# EAGLE design circuitPendulum4TIA01 screenShot (EAGLE 7.7.0)
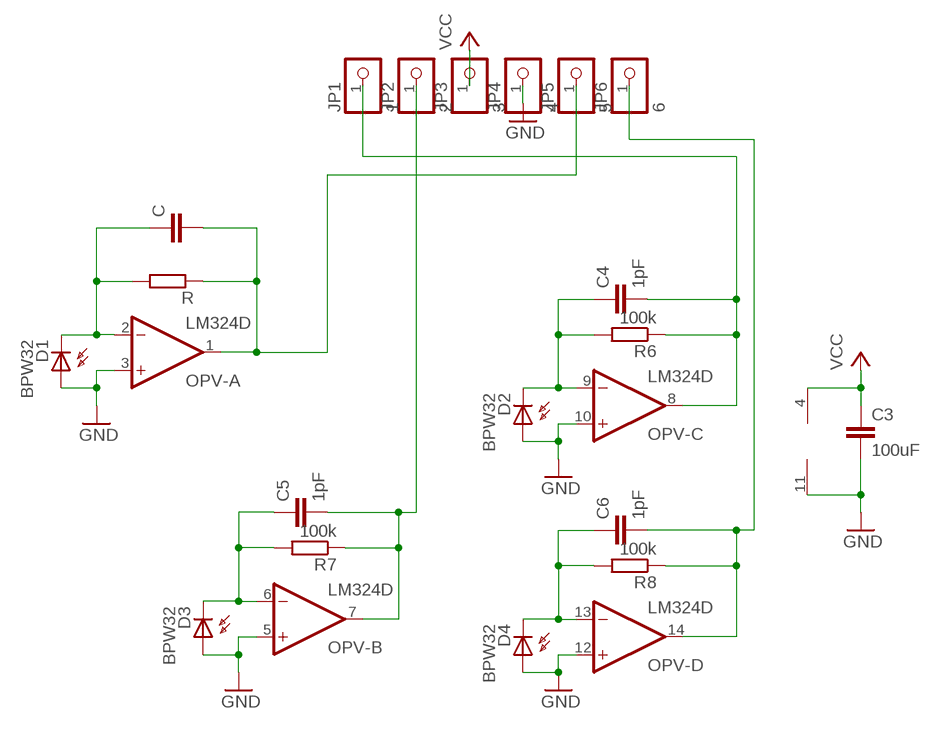
[diagram p0: schematic, sheet 1]

## Parts
C  C-EUC0603  [C0603]
C3  100uF  C-EUC0603  [C0603]
C4  1pF  C-EUC0603  [C0603]
C5  1pF  C-EUC0603  [C0603]
C6  1pF  C-EUC0603  [C0603]
D1  BPW32  [BPW32]
D2  BPW32  [BPW32]
D3  BPW32  [BPW32]
D4  BPW32  [BPW32]
JP1  1  PINHD-1X1_2.54-SMD  [1X01SMD]
JP2  2  PINHD-1X1_2.54-SMD  [1X01SMD]
JP3  3  PINHD-1X1_2.54-SMD  [1X01SMD]
JP4  4  PINHD-1X1_2.54-SMD  [1X01SMD]
JP5  5  PINHD-1X1_2.54-SMD  [1X01SMD]
JP6  6  PINHD-1X1_2.54-SMD  [1X01SMD]
OPV-  LM324D  [SO14]
R  R-EU_R0603  [R0603]
R6  100k  R-EU_R0603  [R0603]
R7  100k  R-EU_R0603  [R0603]
R8  100k  R-EU_R0603  [R0603]

## Nets
GND: C3.2 D1.A D2.A D3.A D4.A JP4.1 OPV-.3(A:+IN) OPV-.5(B:+IN) OPV-.10(C:+IN) OPV-.11(P:V-) OPV-.12(D:+IN)
N$1: C.2 JP5.1 OPV-.1(A:OUT) R.1
N$7: C4.2 JP1.1 OPV-.8(C:OUT) R6.1
N$8: C.1 D1.K(C) OPV-.2(A:-IN) R.2
N$9: C5.1 D3.K(C) OPV-.6(B:-IN) R7.2
N$10: C5.2 JP2.1 OPV-.7(B:OUT) R7.1
N$12: C6.2 JP6.1 OPV-.14(D:OUT) R8.1
N$13: C6.1 D4.K(C) OPV-.13(D:-IN) R8.2
N$14: C4.1 D2.K(C) OPV-.9(C:-IN) R6.2
VCC: C3.1 JP3.1 OPV-.4(P:V+)

## Library data of the parts
C C3-C6 = resistor:C-EU: CAPACITOR, European symbol
D1-D4 = opto-trans-siemens:BPW32: PHOTO DIODE; OC_FARNELL: unknown; OC_NEWARK: unknown
JP1-JP6 = pinhead1:PINHD-1X1: PIN HEADER
OPV- = linear:LM324: OP AMP
R R6-R8 = resistor:R-EU_: RESISTOR, European symbol

## Board
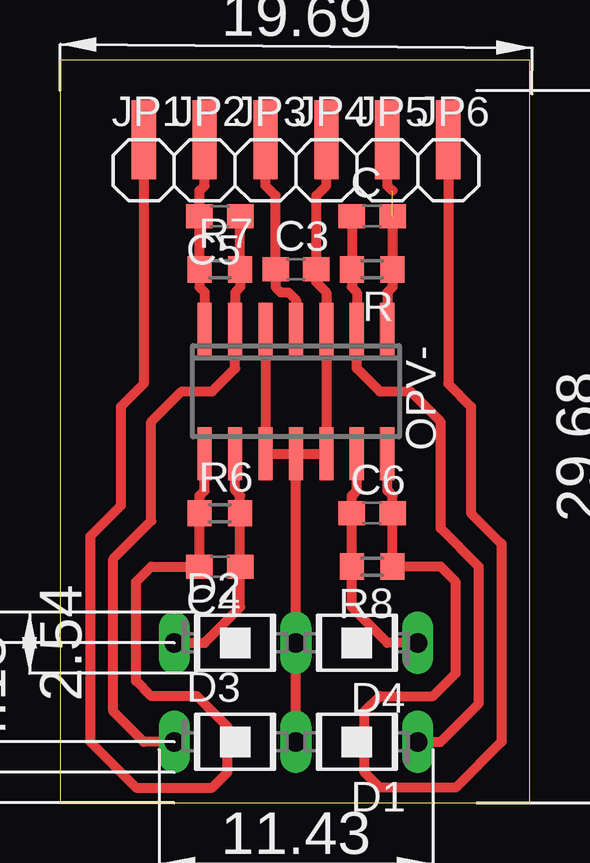
[diagram p1: board, top side]

Size 19.6 x 30.95 mm. Coordinates in mm from the lower left corner, seen from the top.
Outline: 0,0 19.6,0 19.6,30.95 0,30.95 0,0
Copper layers (1*2): Top 0.035mm / dielectric 1.5mm / layer 2 0.035mm
Design rules "Voltera_DRC": minimum track width 10mil, minimum drill 0.6mm, track to track 10mil, track to pad 10mil, pad to pad 10mil, via to via 10mil, smd to smd 0mil, copper to edge 0mil, drill to drill 0.8mm, minimum pad ring 0.2mm, minimum via ring 0.2mm, stop-mask expansion 4mil, vias tented up to drill 0mil, thermal gap 10mil

### Footprints (pad centres in the part's own frame; a part is rotated, then mirrored left to right if it is on the bottom)
C0603 = smd 1.1 x 1: 1 -0.85,0; 2 0.85,0
BPW32 = drill 0.813 long: A 0,2.54; K 0,-2.54
1X01SMD = smd 1.016 x 3.302: 1 -1.27,1.27
SO14 = smd 0.6 x 2.2: 1 -3.81,-2.6; 2 -2.54,-2.6; 3 -1.27,-2.6; 4 0,-2.6; 5 1.27,-2.6; 6 2.54,-2.6; 7 3.81,-2.6; 8 3.81,2.6; 9 2.54,2.6; 10 1.27,2.6; 11 0,2.6; 12 -1.27,2.6; 13 -2.54,2.6; 14 -3.81,2.6
R0603 = smd 1 x 1.1: 1 -0.85,0; 2 0.85,0

### Placement (x,y rotation side)
C  13.02,24.45 0 top
C3  9.84,22.23 0 top
C4  6.67,9.84 180 top
C5  6.67,24.45 180 top
C6  13.02,12.06 0 top
D1  12.38,2.54 90 top
D2  7.3,6.67 270 top
D3  7.3,2.54 270 top
D4  12.38,6.67 90 top
JP1  4.76,26.35 0 top
JP2  7.3,26.35 0 top
JP3  9.84,26.35 0 top
JP4  12.38,26.35 0 top
JP5  14.92,26.35 0 top
JP6  17.46,26.35 0 top
OPV-  9.84,17.14 180 top
R  13.02,22.23 180 top
R6  6.67,12.06 0 top
R7  6.67,22.23 0 top
R8  13.02,9.84 180 top

### Tracks (layer width: path | path; a pad name or v marks a point on that pad's centre or on a via)
GND
  Top 0.406: OPV-.5 OPV-.10 OPV-.11 | OPV-.11 OPV-.12 OPV-.3 11.11,21.27 10.69,21.69 C3.2 10.69,25.3 11.11,25.72 JP4.1 | D3.A D4.A OPV-.11
N$1  (1 unrouted)
  Top 0.406: C.2 R.1 13.87,21.49 13.65,21.27 OPV-.1 | 13.87,25.5 13.65,25.72 JP5.1
N$7
  Top 0.406: OPV-.8 6.03,13.02 5.82,12.8 R6.1 C4.2 3.81,9.84 3.17,9.21 3.17,5.08 3.81,4.45 5.71,4.45 6.99,3.17 6.99,1.27 6.35,0.64 3.17,0.64 1.27,2.54 1.27,11.11 2.54,12.38 2.54,16.51 3.49,17.46 JP1.1
N$8
  Top 0.406: C.1 R.2 12.17,21.49 12.38,21.27 OPV-.2 12.38,18.1 13.34,17.14 14.61,17.14 15.88,15.88 15.88,11.43 17.46,9.84 17.46,4.13 15.88,2.54 D1.K
N$9
  Top 0.406: C5.1 R7.2 7.52,21.49 7.3,21.27 OPV-.6 7.3,18.1 6.35,17.14 5.08,17.14 3.81,15.88 3.81,11.75 2.22,10.16 2.22,3.81 3.49,2.54 D3.K
N$10
  Top 0.406: OPV-.7 6.03,21.27 5.82,21.49 R7.1 C5.2 5.82,25.5 6.03,25.72 JP2.1
N$12
  Top 0.406: OPV-.14 13.65,13.02 13.87,12.8 C6.2 R8.1 15.88,9.84 16.51,9.21 16.51,5.4 15.56,4.45 13.34,4.45 12.7,3.81 12.7,1.27 13.34,0.64 16.51,0.64 18.41,2.54 18.41,10.79 17.14,12.06 17.14,16.51 16.19,17.46 JP6.1
N$13
  Top 0.406: OPV-.13 12.38,13.02 12.17,12.8 C6.1 R8.2 12.17,8.15 13.65,6.67 D4.K
N$14
  Top 0.406: OPV-.9 7.3,13.02 7.52,12.8 R6.2 C4.1 7.52,8.15 6.03,6.67 D2.K
VCC
  Top 0.406: OPV-.4 9.84,20.95 9.53,21.27 9.21,21.27 8.99,21.49 C3.1 8.99,25.3 8.57,25.72 JP3.1